# Altium schematic sheet 04-CTRL2-ps2-blueretro.SchDoc
size A; SheetNumber: 5; SheetTotal: 6
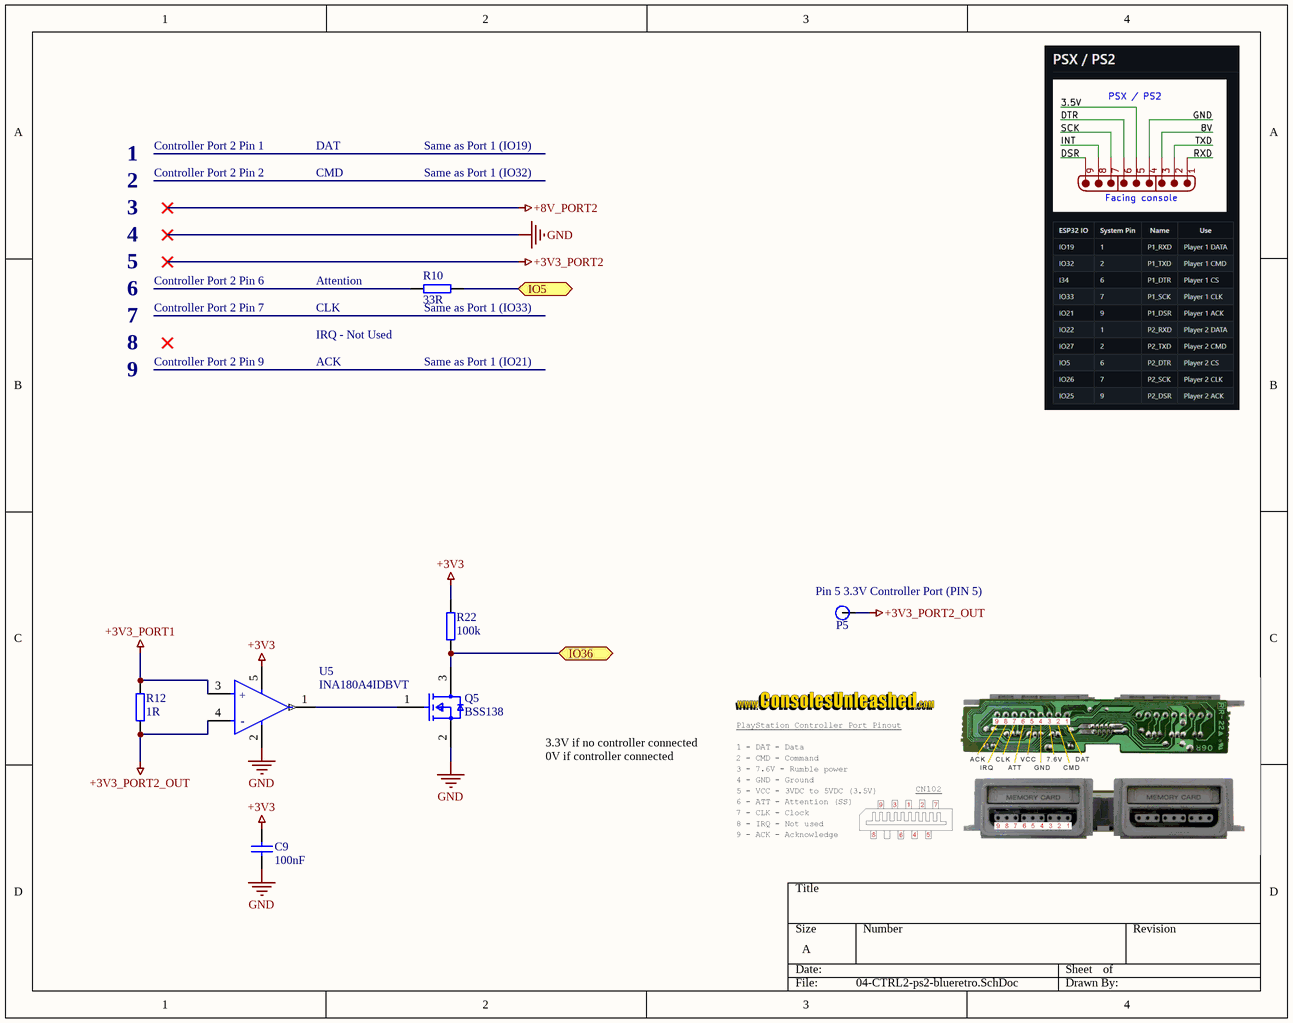
[diagram p0: 04-CTRL2-ps2-blueretro.SchDoc]

## Parts
C9  value 100nF  [res_0402]  (hidden comment: cap_0402)
P5  Solder_Contact_2mm  [SINGLE_SOLDER_CON]  (value not drawn)
Q5  BSS138  [FP-318-08-IPC_B]
R10  value 33R  [res_0402]  (hidden comment: res_0402)
R12  value 1R  [res_0402]  (hidden comment: res_0402)
R22  value 100k  [res_0603]  (hidden comment: res_0603)
U5  INA180A4IDBVT  [FP-DBV0005A-MFG]

## Ports
IO5 (bidir, see 00-ps2-blueretro[3C], 01-ESP32-ps2-blueretro[2B]), IO36 (bidir, see 00-ps2-blueretro[3C], 01-ESP32-ps2-blueretro[2B])

## Nets
+3V3: C9.1 R22.2 U5.5(VS)
+3V3_PORT1: R12.1 U5.3(IN+)
+3V3_PORT2_OUT: P5.1 R12.2 U5.4(IN-)
GND: C9.2 Q5.2(S) U5.2(GND)
IO5: R10.1 ; port IO5
IO36: Q5.3(D) R22.1 ; port IO36
NetQ5_1: Q5.1(G) U5.1(OUT)

Not connected (* = marked no-connect by the designer): R10 2

## Notes on the sheet
- 1
- Controller Port 2 Pin 1
- DAT
- Same as Port 1 (IO19)
- 2
- 3
- Controller Port 2 Pin 2
- CMD
- Same as Port 1 (IO32)
- 4
- 5
- 6
- Controller Port 2 Pin 6
- (near R10) Attention
- 7
- 8
- Controller Port 2 Pin 7
- Controller Port 2 Pin 9
- CLK
- ACK
- (near R10) IRQ - Not Used
- (near R10) Same as Port 1 (IO33)
- Same as Port 1 (IO21)
- 9
- (near P5) Pin 5 3.3V Controller Port (PIN 5)
- 3.3V if no controller connected
  0V if controller connected
- (in symbol CMP-04895-000007-1) +; -

## Library data of the parts
Q5 = CMP-07173-000101-1: MOSFET N-CH 50V 220MA SOT-23; Turn-Off Delay Time: 20ns; Element Configuration: Single; Rds On Max: 3.5R; Gate to Source Voltage (Vgs): 20V; Threshold Voltage: 1.3V; Number of Elements: 1; Power Dissipation: 360mW; Rise Time: 9ns; Turn-On Delay Time: 2.5ns; Input Capacitance: 27pF; On-State Resistance: 6R; Lead Free: Lead Free; Length: 2.92mm; Width: 1.3mm; Drain to Source Breakdown Voltage: 50V; Min Operating Temperature: -55°C; REACH SVHC: No SVHC; Packaging: Tape and Reel; Radiation Hardening: No; Height: 0.93mm; Drain to Source Voltage (Vdss): 50V; Current Rating: 220mA; Voltage Rating (DC): 50V; Weight: 0.03g; Continuous Drain Current (ID): 220mA; Number of Pins: 3; Nominal Vgs: 1.3V; Max Power Dissipation: 360mW; Fall Time: 9ns; Drain to Source Resistance: 3.5R; Contact Plating: Tin; Case/Package: SOT-23; Package Quantity: 1; Dual Supply Voltage: 50V; Mount: Surface Mount; Termination: SMD/SMT; Max Operating Temperature: 150°C
U5 = CMP-04895-000007-1: IC CURR SENSE 1 CIRCUIT SOT23-5; Manufacturer: Texas Instruments; Output Current Per Channel: 8mA; Max Supply Voltage: 5.5V; Input Bias Current: 80uA; Bandwidth: 105kHz; Min Supply Voltage: 2.7V; Input Offset Voltage: 0.1mV; Number Of Channels: 1; Max Junction Temp: +150°C; Standoff Height: 0mm; Nominal Supply Current: 197uA; Voltage Gain: 0.2V/mV; Temperature: -40°C to +125°C; RoHS: TRUE; Ambient Temperature Range High: +125°C; Device Class L3: Instrumentation; Temperature Range High: +125°C; Height: 1.45mm; Octopart: https://octopart.com/ina180a4idbvt-texas+instruments-81856280; ComponentLink2Description: Datasheet; Digikey Description: IC CURR SENSE 1 CIRCUIT SOT23-5; Category: IC; ComponentLink2URL: http://www.ti.com/lit/ds/symlink/ina180.pdf; Ambient Temperature Range Low: -40°C; Temperature Range Low: -40°C; Automotive: No; Package: DBV0005A; Device Class L1: Integrated Circuits (ICs); Ipc Land Pattern Name: SOT95P280X145-5; Manufacturer Part Number: INA180A4IDBVT; Device Class L2: Linear ICs; Lead Free: Yes